# EAGLE schematic main_V3.0 (EAGLE 7.2.0)

## Sheet 1 of 3
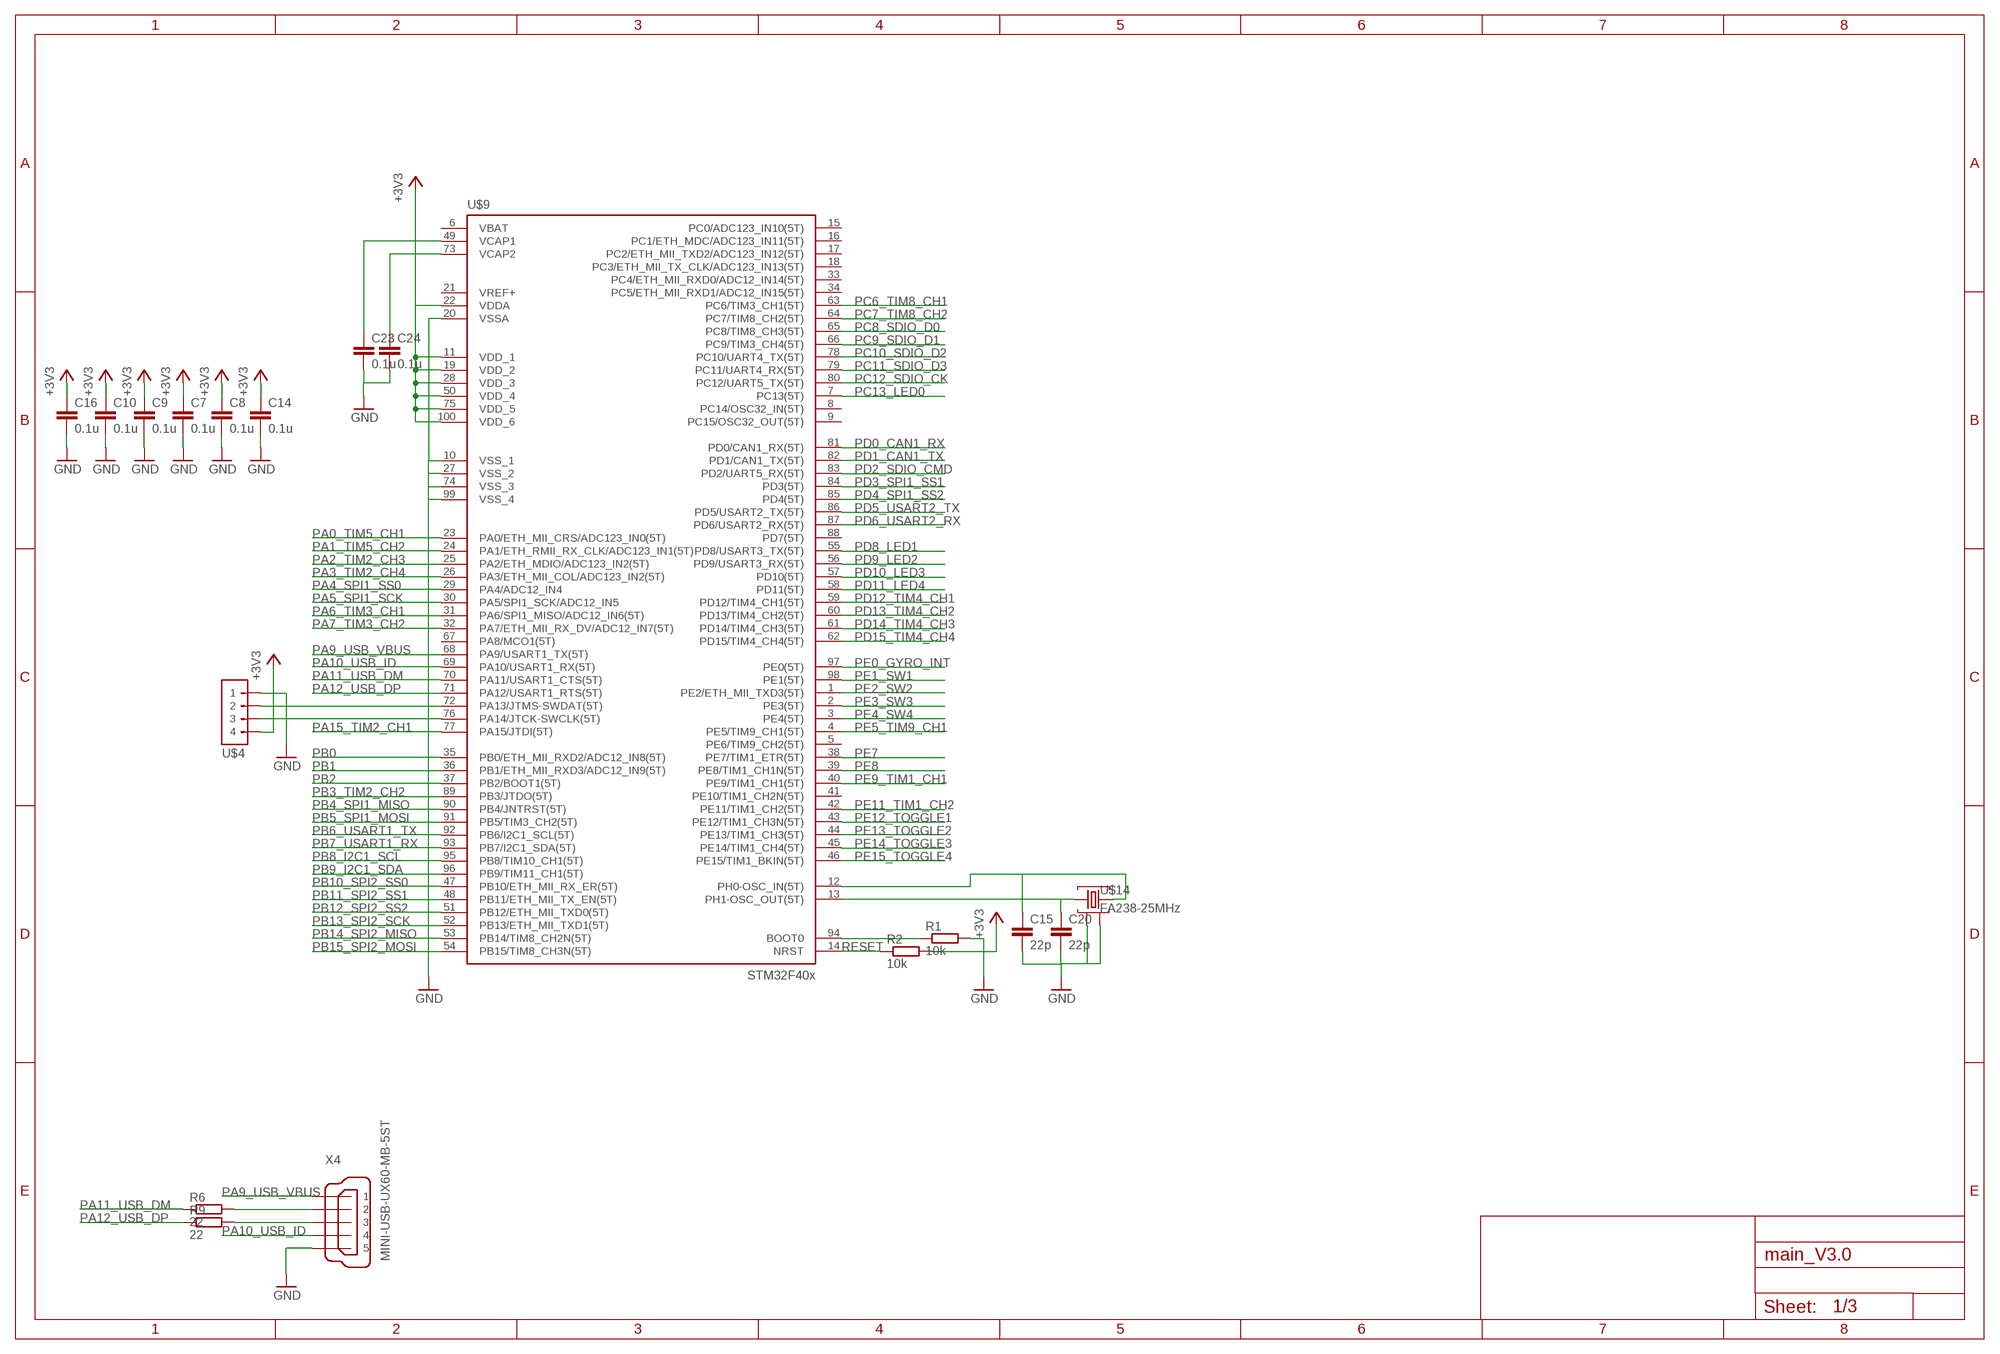
[diagram p0: schematic, sheet 1]

### Parts
C7  0.1u  C-EUC0603K  [C0603K]
C8  0.1u  C-EUC0603K  [C0603K]
C9  0.1u  C-EUC0603K  [C0603K]
C10  0.1u  C-EUC0603K  [C0603K]
C14  0.1u  C-EUC0603K  [C0603K]
C15  22p  C-EUC0603K  [C0603K]
C16  0.1u  C-EUC0603K  [C0603K]
C20  22p  C-EUC0603K  [C0603K]
C23  0.1u  C-EUC0603K  [C0603K]
C24  0.1u  C-EUC0603K  [C0603K]
R1  10k  R-EU_R0603  [R0603]
R2  10k  R-EU_R0603  [R0603]
R6  22  R-EU_R0603  [R0603]
R9  22  R-EU_R0603  [R0603]
U$4  TOP_TYPE_4PIN  [TOP_TYPE_4PIN]
U$9  STM32F407V  [TQFP100]
U$14  FA238-25MHz  FA238  [ASF]
X4  MINI-USB-UX60-MB-5ST  [UX60-MB-5ST]

### Nets
+3V3 [VCC]: C7.1 C8.1 C9.1 C10.1 C14.1 C16.1 R2.2 U$4.4 U$9.11(VDD_1) U$9.19(VDD_2) U$9.22(VDDA) U$9.28(VDD_3) U$9.50(VDD_4) U$9.75(VDD_5) U$9.100(VDD_6) ; also sheet 2,3
GND [GND]: C7.2 C8.2 C9.2 C10.2 C14.2 C15.2 C16.2 C20.2 C23.2 C24.2 R1.2 U$4.1 U$9.10(VSS_1) U$9.20(VSSA) U$9.27(VSS_2) U$9.74(VSS_3) U$9.99(VSS_4) U$14.2 U$14.4 X4.5 ; also sheet 2,3
N$4: R6.2 X4.2
N$5: R9.2 X4.3
N$17: U$4.2 U$9.72(PA13/JTMS-SWDAT(5T))
N$18: U$4.3 U$9.76(PA14/JTCK-SWCLK(5T))
N$19: C15.1 U$9.12(PH0-OSC_IN(5T)) U$14.3
N$20: C20.1 U$9.13(PH1-OSC_OUT(5T)) U$14.1
N$22: R1.1 U$9.94(BOOT0)
N$23: C24.1 U$9.73(VCAP2)
N$27: C23.1 U$9.49(VCAP1)
PA0_TIM5_CH1: U$9.23(PA0/ETH_MII_CRS/ADC123_IN0(5T)) ; also sheet 2
PA1_TIM5_CH2: U$9.24(PA1/ETH_RMII_RX_CLK/ADC123_IN1(5T)) ; also sheet 2
PA2_TIM2_CH3: U$9.25(PA2/ETH_MDIO/ADC123_IN2(5T)) ; also sheet 2
PA3_TIM2_CH4: U$9.26(PA3/ETH_MII_COL/ADC123_IN2(5T)) ; also sheet 2
PA4_SPI1_SS0: U$9.29(PA4/ADC12_IN4) ; also sheet 2
PA5_SPI1_SCK: U$9.30(PA5/SPI1_SCK/ADC12_IN5) ; also sheet 2
PA6_TIM3_CH1: U$9.31(PA6/SPI1_MISO/ADC12_IN6(5T)) ; also sheet 2
PA7_TIM3_CH2: U$9.32(PA7/ETH_MII_RX_DV/ADC12_IN7(5T)) ; also sheet 2
PA9_USB_VBUS: U$9.68(PA9/USART1_TX(5T)) X4.1
PA10_USB_ID: U$9.69(PA10/USART1_RX(5T)) X4.4
PA11_USB_DM: R6.1 U$9.70(PA11/USART1_CTS(5T))
PA12_USB_DP: R9.1 U$9.71(PA12/USART1_RTS(5T))
PA15_TIM2_CH1: U$9.77(PA15/JTDI(5T)) ; also sheet 2
PB0: U$9.35(PB0/ETH_MII_RXD2/ADC12_IN8(5T)) ; also sheet 2
PB1: U$9.36(PB1/ETH_MII_RXD3/ADC12_IN9(5T)) ; also sheet 2
PB2: U$9.37(PB2/BOOT1(5T)) ; also sheet 2
PB3_TIM2_CH2: U$9.89(PB3/JTDO(5T)) ; also sheet 2
PB4_SPI1_MISO: U$9.90(PB4/JNTRST(5T)) ; also sheet 2
PB5_SPI1_MOSI: U$9.91(PB5/TIM3_CH2(5T)) ; also sheet 2
PB6_USART1_TX: U$9.92(PB6/I2C1_SCL(5T)) ; also sheet 2
PB7_USART1_RX: U$9.93(PB7/I2C1_SDA(5T)) ; also sheet 2
PB8_I2C1_SCL: U$9.95(PB8/TIM10_CH1(5T)) ; also sheet 3
PB9_I2C1_SDA: U$9.96(PB9/TIM11_CH1(5T)) ; also sheet 3
PB10_SPI2_SS0: U$9.47(PB10/ETH_MII_RX_ER(5T)) ; also sheet 2
PB11_SPI2_SS1: U$9.48(PB11/ETH_MII_TX_EN(5T)) ; also sheet 2
PB12_SPI2_SS2: U$9.51(PB12/ETH_MII_TXD0(5T)) ; also sheet 2
PB13_SPI2_SCK: U$9.52(PB13/ETH_MII_TXD1(5T)) ; also sheet 2
PB14_SPI2_MISO: U$9.53(PB14/TIM8_CH2N(5T)) ; also sheet 2
PB15_SPI2_MOSI: U$9.54(PB15/TIM8_CH3N(5T)) ; also sheet 2
PC6_TIM8_CH1: U$9.63(PC6/TIM3_CH1(5T)) ; also sheet 2
PC7_TIM8_CH2: U$9.64(PC7/TIM8_CH2(5T)) ; also sheet 2
PC8_SDIO_D0: U$9.65(PC8/TIM8_CH3(5T)) ; also sheet 2
PC9_SDIO_D1: U$9.66(PC9/TIM3_CH4(5T)) ; also sheet 2
PC10_SDIO_D2: U$9.78(PC10/UART4_TX(5T)) ; also sheet 2
PC11_SDIO_D3: U$9.79(PC11/UART4_RX(5T)) ; also sheet 2
PC12_SDIO_CK: U$9.80(PC12/UART5_TX(5T)) ; also sheet 2
PC13_LED0: U$9.7(PC13(5T)) ; also sheet 3
PD0_CAN1_RX: U$9.81(PD0/CAN1_RX(5T)) ; also sheet 2
PD1_CAN1_TX: U$9.82(PD1/CAN1_TX(5T)) ; also sheet 2
PD2_SDIO_CMD: U$9.83(PD2/UART5_RX(5T)) ; also sheet 2
PD3_SPI1_SS1: U$9.84(PD3(5T)) ; also sheet 2
PD4_SPI1_SS2: U$9.85(PD4(5T)) ; also sheet 2
PD5_USART2_TX: U$9.86(PD5/USART2_TX(5T)) ; also sheet 2
PD6_USART2_RX: U$9.87(PD6/USART2_RX(5T)) ; also sheet 2
PD8_LED1: U$9.55(PD8/USART3_TX(5T)) ; also sheet 3
PD9_LED2: U$9.56(PD9/USART3_RX(5T)) ; also sheet 3
PD10_LED3: U$9.57(PD10(5T)) ; also sheet 3
PD11_LED4: U$9.58(PD11(5T)) ; also sheet 3
PD12_TIM4_CH1: U$9.59(PD12/TIM4_CH1(5T)) ; also sheet 2
PD13_TIM4_CH2: U$9.60(PD13/TIM4_CH2(5T)) ; also sheet 2
PD14_TIM4_CH3: U$9.61(PD14/TIM4_CH3(5T)) ; also sheet 2
PD15_TIM4_CH4: U$9.62(PD15/TIM4_CH4(5T)) ; also sheet 2
PE0_GYRO_INT: U$9.97(PE0(5T)) ; also sheet 3
PE1_SW1: U$9.98(PE1(5T)) ; also sheet 3
PE2_SW2: U$9.1(PE2/ETH_MII_TXD3(5T)) ; also sheet 3
PE3_SW3: U$9.2(PE3(5T)) ; also sheet 3
PE4_SW4: U$9.3(PE4(5T)) ; also sheet 3
PE5_TIM9_CH1: U$9.4(PE5/TIM9_CH1(5T)) ; also sheet 3
PE7: U$9.38(PE7/TIM1_ETR(5T)) ; also sheet 2
PE8: U$9.39(PE8/TIM1_CH1N(5T)) ; also sheet 2
PE9_TIM1_CH1: U$9.40(PE9/TIM1_CH1(5T)) ; also sheet 2
PE11_TIM1_CH2: U$9.42(PE11/TIM1_CH2(5T)) ; also sheet 2
PE12_TOGGLE1: U$9.43(PE12/TIM1_CH3N(5T)) ; also sheet 3
PE13_TOGGLE2: U$9.44(PE13/TIM1_CH3(5T)) ; also sheet 3
PE14_TOGGLE3: U$9.45(PE14/TIM1_CH4(5T)) ; also sheet 3
PE15_TOGGLE4: U$9.46(PE15/TIM1_BKIN(5T)) ; also sheet 3
RESET: R2.1 U$9.14(NRST) ; also sheet 2,3
Unconnected: U$9.5(PE6/TIM9_CH2(5T)) U$9.6(VBAT) U$9.8(PC14/OSC32_IN(5T)) U$9.9(PC15/OSC32_OUT(5T)) U$9.15(PC0/ADC123_IN10(5T)) U$9.16(PC1/ETH_MDC/ADC123_IN11(5T)) U$9.17(PC2/ETH_MII_TXD2/ADC123_IN12(5T)) U$9.18(PC3/ETH_MII_TX_CLK/ADC123_IN13(5T)) U$9.21(VREF+) U$9.33(PC4/ETH_MII_RXD0/ADC12_IN14(5T)) U$9.34(PC5/ETH_MII_RXD1/ADC12_IN15(5T)) U$9.41(PE10/TIM1_CH2N(5T)) U$9.67(PA8/MCO1(5T)) U$9.88(PD7(5T))

## Sheet 2 of 3
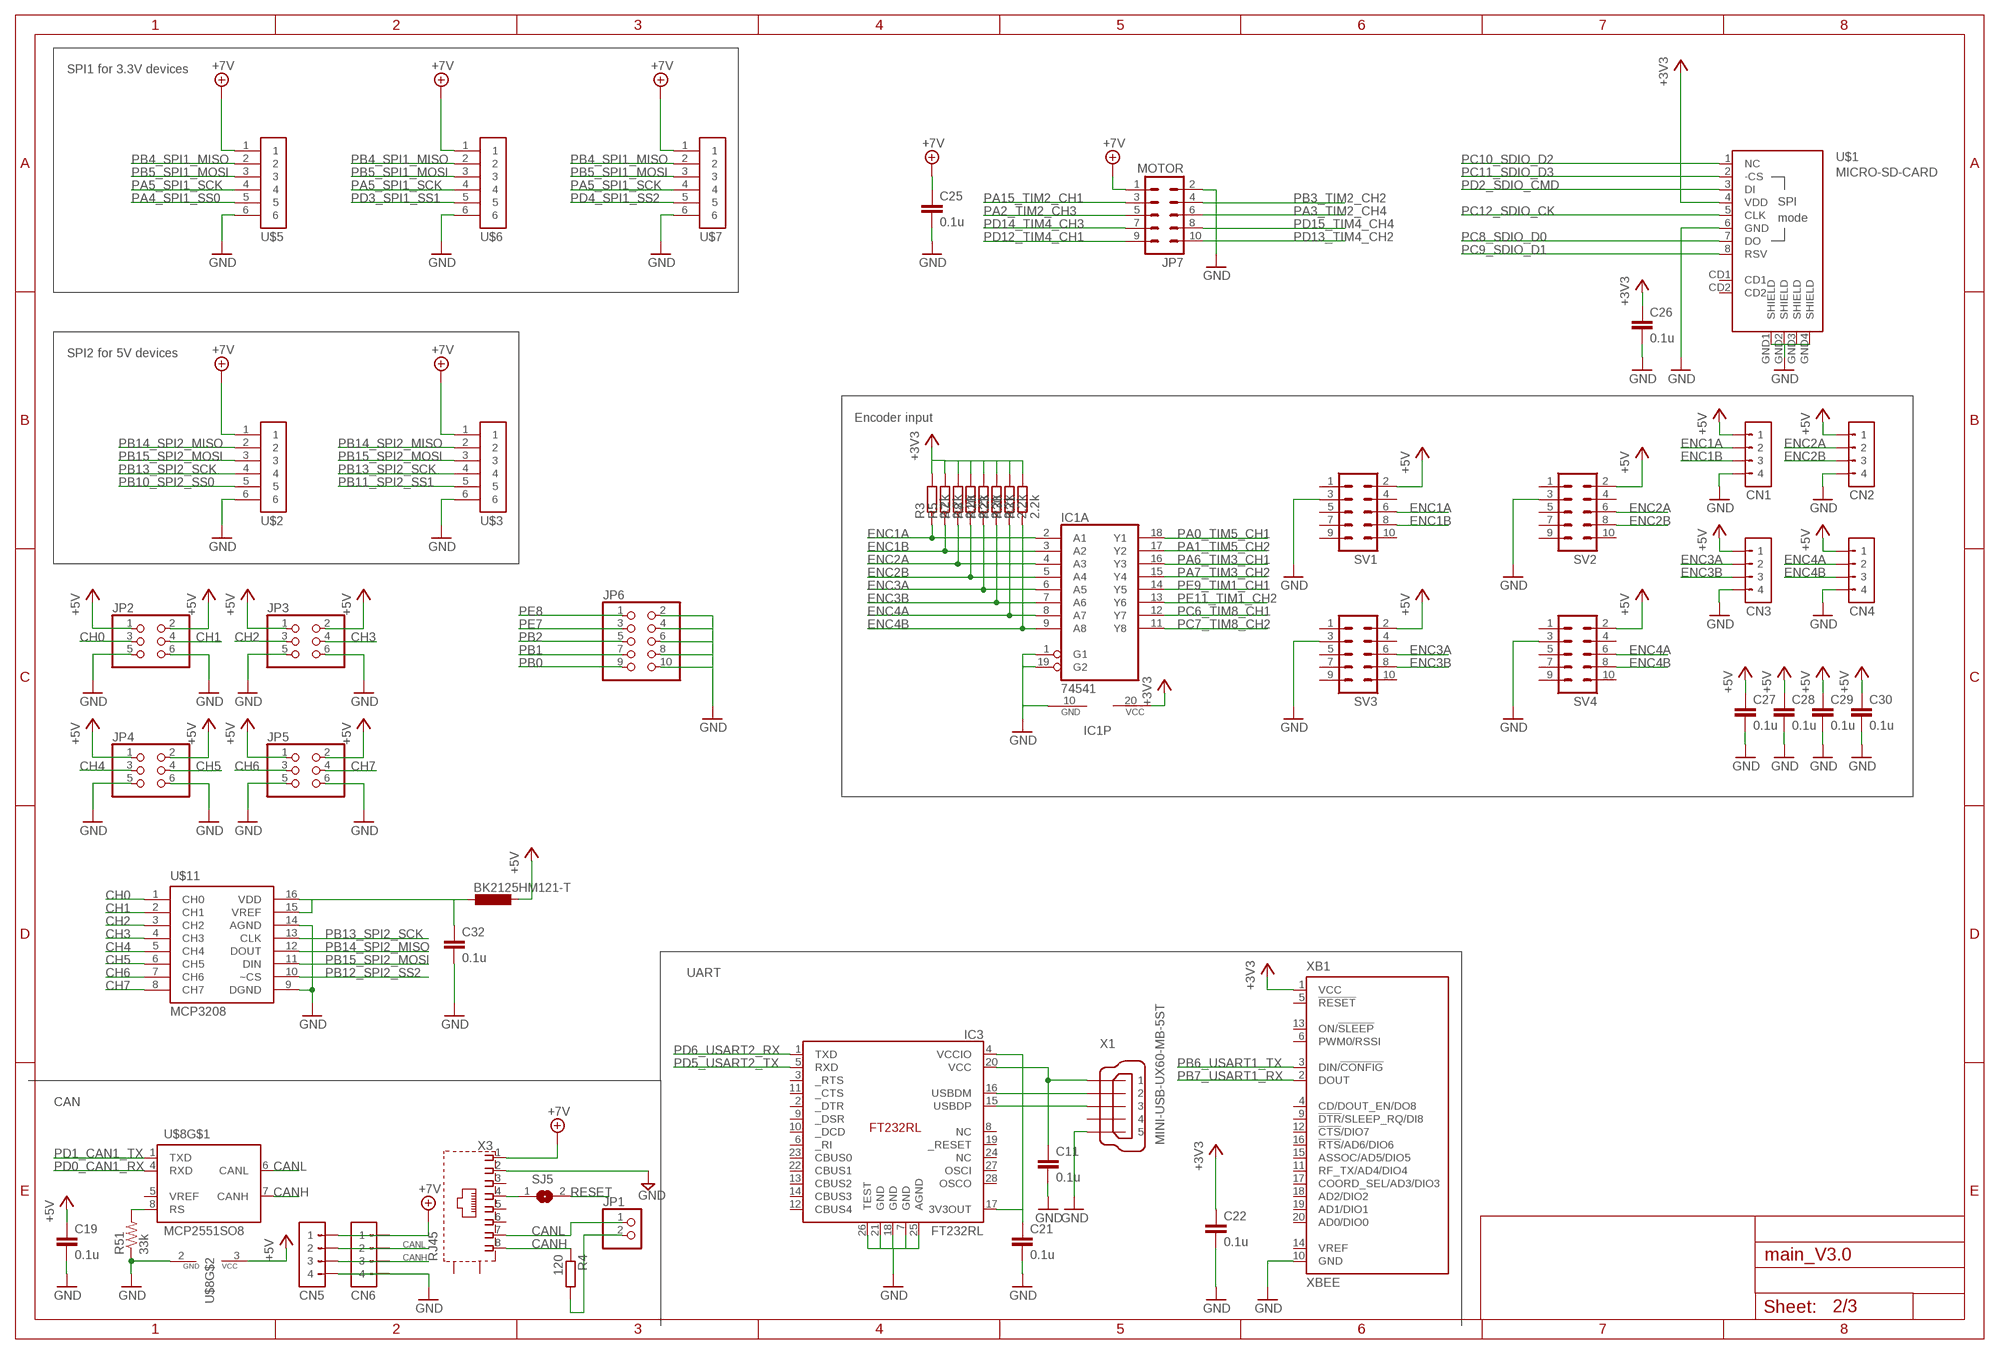
[diagram p1: schematic, sheet 2]

### Parts
BK2125HM121-T  L-EUL2012C  [L2012C]
C11  0.1u  C-EUC0603K  [C0603K]
C19  0.1u  C-EUC0603K  [C0603K]
C21  0.1u  C-EUC0603K  [C0603K]
C22  0.1u  C-EUC0603K  [C0603K]
C25  0.1u  C-EUC0603K  [C0603K]
C26  0.1u  C-EUC0603K  [C0603K]
C27  0.1u  C-EUC0603K  [C0603K]
C28  0.1u  C-EUC0603K  [C0603K]
C29  0.1u  C-EUC0603K  [C0603K]
C30  0.1u  C-EUC0603K  [C0603K]
C32  0.1u  C-EUC0603K  [C0603K]
CN1  CN4-JST-XH-TOP  [JST-B4B-XH-A]
CN2  CN4-JST-XH-TOP  [JST-B4B-XH-A]
CN3  CN4-JST-XH-TOP  [JST-B4B-XH-A]
CN4  CN4-JST-XH-TOP  [JST-B4B-XH-A]
CN5  CN4-JST-XH-TOP  [JST-B4B-XH-A]
CN6  CN4-JST-XH-TOP  [JST-B4B-XH-A]
IC1  74541  [SOP20]
IC3  FT232RL  [SSOP-28]
JP1  PINHD-1X2  [1X02]
JP2  PINHD-2X3/90  [2X03/90]
JP3  PINHD-2X3/90  [2X03/90]
JP4  PINHD-2X3/90  [2X03/90]
JP5  PINHD-2X3/90  [2X03/90]
JP6  PINHD-2X5/90  [2X05/90]
JP7  MOTOR  ML10L  [ML10L]
R3  2.2k  R-EU_R0603  [R0603]
R4  120  R-EU_R0603  [R0603]
R5  2.2k  R-EU_R0603  [R0603]
R7  2.2k  R-EU_R0603  [R0603]
R8  2.2k  R-EU_R0603  [R0603]
R10  2.2k  R-EU_R0603  [R0603]
R23  2.2k  R-EU_R0603  [R0603]
R30  2.2k  R-EU_R0603  [R0603]
R31  2.2k  R-EU_R0603  [R0603]
R51  33k  R-US_R0603  [R0603]
SJ5  SJ  [SJ]
SV1  ML10L  [ML10L]
SV2  ML10L  [ML10L]
SV3  ML10L  [ML10L]
SV4  ML10L  [ML10L]
U$1  MICRO-SD-CARD  [DM3AT-SF-PEJ]
U$2  CN6  [JST-B6B-XH-A]
U$3  CN6  [JST-B6B-XH-A]
U$5  CN6  [JST-B6B-XH-A]
U$6  CN6  [JST-B6B-XH-A]
U$7  CN6  [JST-B6B-XH-A]
U$8  MCP2551SO8  [SO08]
U$11  MCP3208  [SO16]
X1  MINI-USB-UX60-MB-5ST  [UX60-MB-5ST]
X3  RJ45  [LAN]
XB1  XBEE  [XBEE]

### Nets
+3V3 [VCC]: C22.1 C26.1 IC1.20(P:VCC) R3.2 R5.2 R7.2 R8.2 R10.2 R23.2 R30.2 R31.2 U$1.4(VDD) XB1.1(VCC) ; also sheet 1,3
+5V [VCC]: BK2125HM121-T.1 C19.1 C27.1 C28.1 C29.1 C30.1 CN1.1 CN2.1 CN3.1 CN4.1 JP2.1 JP2.2 JP3.1 JP3.2 JP4.1 JP4.2 JP5.1 JP5.2 SV1.2 SV2.2 SV3.2 SV4.2 U$8.3(VCC) ; also sheet 3
+7V [VCC]: C25.1 CN5.1 CN6.1 JP7.1 U$2.1 U$3.1 U$5.1 U$6.1 U$7.1 X3.1 ; also sheet 3
CANH: CN5.3 CN6.3 R4.1 U$8.7(CANH) X3.8
CANL: CN5.2 CN6.2 JP1.1 U$8.6(CANL) X3.7
CH0: JP2.3 U$11.1(CH0)
CH1: JP2.4 U$11.2(CH1)
CH2: JP3.3 U$11.3(CH2)
CH3: JP3.4 U$11.4(CH3)
CH4: JP4.3 U$11.5(CH4)
CH5: JP4.4 U$11.6(CH5)
CH6: JP5.3 U$11.7(CH6)
CH7: JP5.4 U$11.8(CH7)
ENC1A: CN1.2 IC1.2(A:A1) R3.1 SV1.6
ENC1B: CN1.3 IC1.3(A:A2) R5.1 SV1.8
ENC2A: CN2.2 IC1.4(A:A3) R7.1 SV2.6
ENC2B: CN2.3 IC1.5(A:A4) R8.1 SV2.8
ENC3A: CN3.2 IC1.6(A:A5) R10.1 SV3.6
ENC3B: CN3.3 IC1.7(A:A6) R23.1 SV3.8
ENC4A: CN4.2 IC1.8(A:A7) R30.1 SV4.6
ENC4B: CN4.3 IC1.9(A:A8) R31.1 SV4.8
GND [GND]: C11.2 C19.2 C21.2 C22.2 C25.2 C26.2 C27.2 C28.2 C29.2 C30.2 C32.2 CN1.4 CN2.4 CN3.4 CN4.4 CN5.4 CN6.4 IC1.1(A:G1) IC1.10(P:GND) IC1.19(A:G2) IC3.7(GND) IC3.18(GND) IC3.21(GND) IC3.25(AGND) IC3.26(TEST) JP2.5 JP2.6 JP3.5 JP3.6 JP4.5 JP4.6 JP5.5 JP5.6 JP6.2 JP6.4 JP6.6 JP6.8 JP6.10 JP7.2 R51.1 SV1.3 SV2.3 SV3.3 SV4.3 U$1.6(GND) U$1.GND1(SHIELD) U$1.GND2(SHIELD) U$1.GND3(SHIELD) U$1.GND4(SHIELD) U$2.6 U$3.6 U$5.6 U$6.6 U$7.6 U$8.2(GND) U$11.9(DGND) U$11.14(AGND) X1.5 X3.2 XB1.10(GND) ; also sheet 1,3
N$2: IC3.16(USBDM) X1.2
N$3: IC3.15(USBDP) X1.3
N$9: R51.2 U$8.8(RS)
N$11: SJ5.1 X3.4
N$14 [VCC]: C11.1 IC3.20(VCC) X1.1
N$25: JP1.2 R4.2
N$26: BK2125HM121-T.2 C32.1 U$11.15(VREF) U$11.16(VDD)
N$38 [VCC]: C21.1 IC3.4(VCCIO) IC3.17(3V3OUT)
PA0_TIM5_CH1: IC1.18(A:Y1) ; also sheet 1
PA1_TIM5_CH2: IC1.17(A:Y2) ; also sheet 1
PA2_TIM2_CH3: JP7.5 ; also sheet 1
PA3_TIM2_CH4: JP7.6 ; also sheet 1
PA4_SPI1_SS0: U$5.5 ; also sheet 1
PA5_SPI1_SCK: U$5.4 U$6.4 U$7.4 ; also sheet 1
PA6_TIM3_CH1: IC1.16(A:Y3) ; also sheet 1
PA7_TIM3_CH2: IC1.15(A:Y4) ; also sheet 1
PA15_TIM2_CH1: JP7.3 ; also sheet 1
PB0: JP6.9 ; also sheet 1
PB1: JP6.7 ; also sheet 1
PB2: JP6.5 ; also sheet 1
PB3_TIM2_CH2: JP7.4 ; also sheet 1
PB4_SPI1_MISO: U$5.2 U$6.2 U$7.2 ; also sheet 1
PB5_SPI1_MOSI: U$5.3 U$6.3 U$7.3 ; also sheet 1
PB6_USART1_TX: XB1.3(DIN/!CONFIG) ; also sheet 1
PB7_USART1_RX: XB1.2(DOUT) ; also sheet 1
PB10_SPI2_SS0: U$2.5 ; also sheet 1
PB11_SPI2_SS1: U$3.5 ; also sheet 1
PB12_SPI2_SS2: U$11.10(~CS) ; also sheet 1
PB13_SPI2_SCK: U$2.4 U$3.4 U$11.13(CLK) ; also sheet 1
PB14_SPI2_MISO: U$2.2 U$3.2 U$11.12(DOUT) ; also sheet 1
PB15_SPI2_MOSI: U$2.3 U$3.3 U$11.11(DIN) ; also sheet 1
PC6_TIM8_CH1: IC1.12(A:Y7) ; also sheet 1
PC7_TIM8_CH2: IC1.11(A:Y8) ; also sheet 1
PC8_SDIO_D0: U$1.7(DO) ; also sheet 1
PC9_SDIO_D1: U$1.8(RSV) ; also sheet 1
PC10_SDIO_D2: U$1.1(NC) ; also sheet 1
PC11_SDIO_D3: U$1.2(-CS) ; also sheet 1
PC12_SDIO_CK: U$1.5(CLK) ; also sheet 1
PD0_CAN1_RX: U$8.4(RXD) ; also sheet 1
PD1_CAN1_TX: U$8.1(TXD) ; also sheet 1
PD2_SDIO_CMD: U$1.3(DI) ; also sheet 1
PD3_SPI1_SS1: U$6.5 ; also sheet 1
PD4_SPI1_SS2: U$7.5 ; also sheet 1
PD5_USART2_TX: IC3.5(RXD) ; also sheet 1
PD6_USART2_RX: IC3.1(TXD) ; also sheet 1
PD12_TIM4_CH1: JP7.9 ; also sheet 1
PD13_TIM4_CH2: JP7.10 ; also sheet 1
PD14_TIM4_CH3: JP7.7 ; also sheet 1
PD15_TIM4_CH4: JP7.8 ; also sheet 1
PE7: JP6.3 ; also sheet 1
PE8: JP6.1 ; also sheet 1
PE9_TIM1_CH1: IC1.14(A:Y5) ; also sheet 1
PE11_TIM1_CH2: IC1.13(A:Y6) ; also sheet 1
RESET: SJ5.2 ; also sheet 1,3
Unconnected: IC3.2(_DTR) IC3.3(_RTS) IC3.6(_RI) IC3.8(NC) IC3.9(_DSR) IC3.10(_DCD) IC3.11(_CTS) IC3.12(CBUS4) IC3.13(CBUS2) IC3.14(CBUS3) IC3.19(_RESET) IC3.22(CBUS1) IC3.23(CBUS0) IC3.24(NC) IC3.27(OSCI) IC3.28(OSCO) SV1.1 SV1.4 SV1.5 SV1.7 SV1.9 SV1.10 SV2.1 SV2.4 SV2.5 SV2.7 SV2.9 SV2.10 SV3.1 SV3.4 SV3.5 SV3.7 SV3.9 SV3.10 SV4.1 SV4.4 SV4.5 SV4.7 SV4.9 SV4.10 U$1.CD1 U$1.CD2 U$8.5(VREF) X1.4 X3.3 X3.5 X3.6 X3.P$11(S) X3.P$12(S) XB1.4(CD/DOUT_EN/DO8) XB1.5(!RESET) XB1.6(PWM0/RSSI) XB1.9(!DTR!/SLEEP_RQ/DI8) XB1.11(RF_TX/AD4/DIO4) XB1.12(!CTS!/DIO7) XB1.13(ON/!SLEEP) XB1.14(VREF) XB1.15(ASSOC/AD5/DIO5) XB1.16(!RTS!/AD6/DIO6) XB1.17(COORD_SEL/AD3/DIO3) XB1.18(AD2/DIO2) XB1.19(AD1/DIO1) XB1.20(AD0/DIO0)

### Notes on the sheet
- SPI1 for 3.3V devices
- SPI2 for 5V devices
- Encoder input
- UART
- CAN

## Sheet 3 of 3
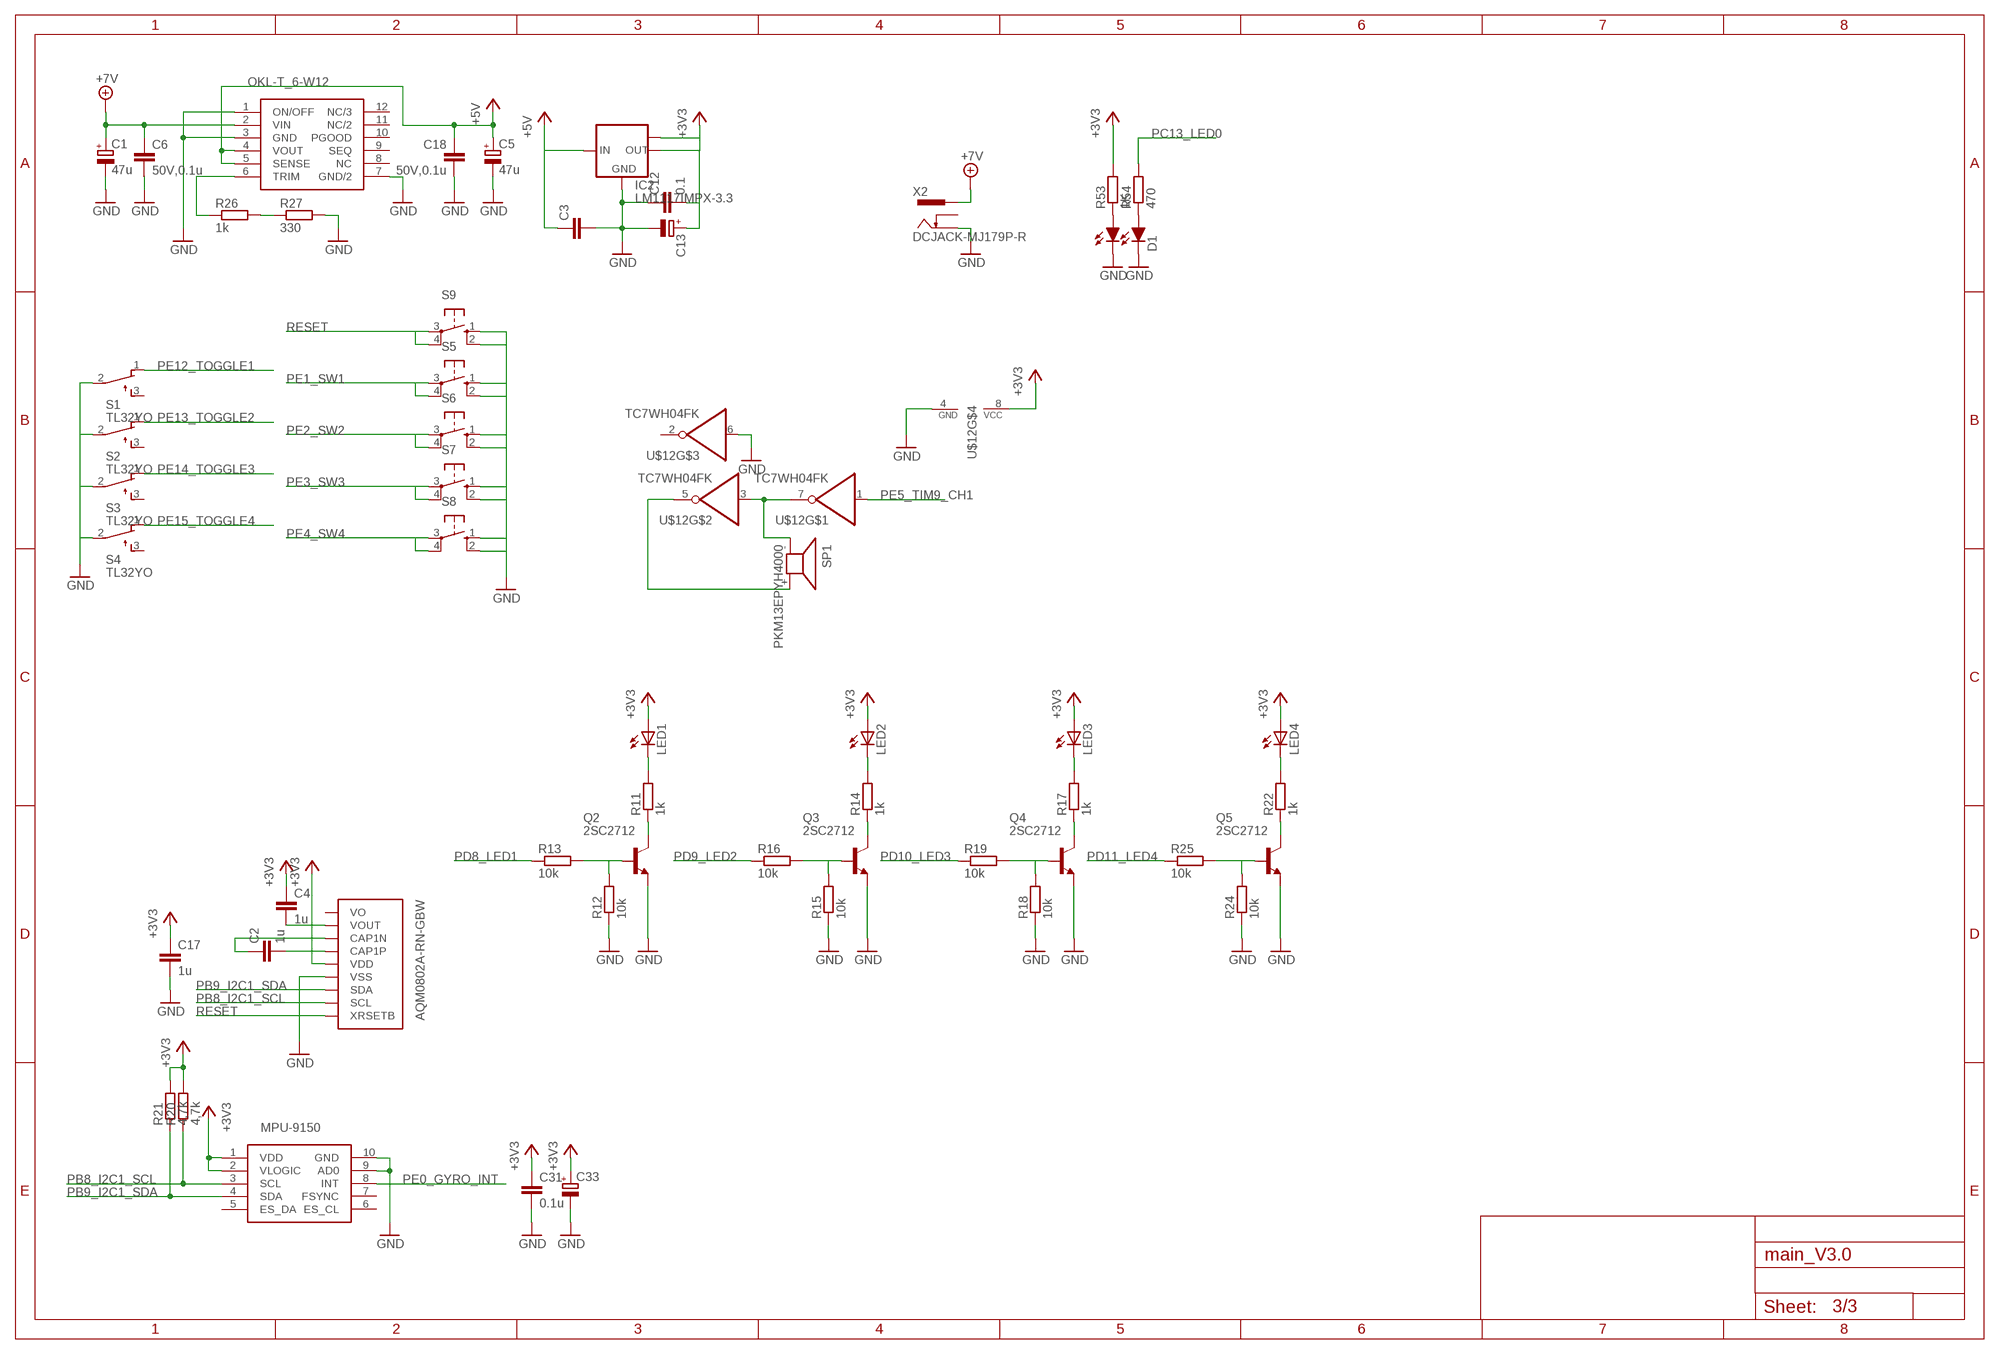
[diagram p2: schematic, sheet 3]

### Parts
AQM0802A-RN-GBW  AQM0802A-RN-GBW  [AQM0802]
C1  47u  CPOL-EU153CLV-0405  [153CLV-0405]
C2  1u  C-EUC0603K  [C0603K]
C3  C-EUC0603  [C0603]
C4  1u  C-EUC0603K  [C0603K]
C5  47u  CPOL-EU153CLV-0405  [153CLV-0405]
C6  50V,0.1u  C-EUC0603K  [C0603K]
C12  0.1  C-EUC0603  [C0603]
C13  CPOL-EU153CLV-0505  [153CLV-0505]
C17  1u  C-EUC0603K  [C0603K]
C18  50V,0.1u  C-EUC0603K  [C0603K]
C31  0.1u  C-EUC0603K  [C0603K]
C33  CPOL-EU153CLV-0505  [153CLV-0505]
D1  SEC2XX4  [LED3025]
IC2  LM1117IMPX-3.3  [SOT223]
LED1  LEDSML0603  [SML0603]
LED2  LEDSML0603  [SML0603]
LED3  LEDSML0603  [SML0603]
LED4  LEDSML0603  [SML0603]
Q2  2SC2712  [SC-59(TYPE1)]
Q3  2SC2712  [SC-59(TYPE1)]
Q4  2SC2712  [SC-59(TYPE1)]
Q5  2SC2712  [SC-59(TYPE1)]
R11  1k  R-EU_R0603  [R0603]
R12  10k  R-EU_R0603  [R0603]
R13  10k  R-EU_R0603  [R0603]
R14  1k  R-EU_R0603  [R0603]
R15  10k  R-EU_R0603  [R0603]
R16  10k  R-EU_R0603  [R0603]
R17  1k  R-EU_R0603  [R0603]
R18  10k  R-EU_R0603  [R0603]
R19  10k  R-EU_R0603  [R0603]
R20  4,7k  R-EU_R0603  [R0603]
R21  4,7k  R-EU_R0603  [R0603]
R22  1k  R-EU_R0603  [R0603]
R24  10k  R-EU_R0603  [R0603]
R25  10k  R-EU_R0603  [R0603]
R26  1k  R-EU_R0603  [R0603]
R27  330  R-EU_R0603  [R0603]
R53  1K  R-EU_R0603  [R0603]
R54  470  R-EU_R0603  [R0603]
S1  TL32YO  [TL3XYO]
S2  TL32YO  [TL3XYO]
S3  TL32YO  [TL3XYO]
S4  TL32YO  [TL3XYO]
S5  10-XX  [B3F-10XX]
S6  10-XX  [B3F-10XX]
S7  10-XX  [B3F-10XX]
S8  10-XX  [B3F-10XX]
S9  10-XX  [B3F-10XX]
SP1  PKM13EPYH4000  AL11P  [AL11P]
U$10  MPU-9150  [MPU-9150]
U$12  TC7WH04FK  [SSOP08]
U$13  OKL-T/6-W12N  [OKL-T/6-W12]
X2  DCJACK-MJ179P-R  [MJ-179P-R]

### Nets
+3V3 [VCC]: AQM0802A-RN-GBW.P$5(VDD) C4.1 C12.2 C13.+ C17.1 C31.1 C33.+ IC2.2(OUT) IC2.TAB(OUT1) LED1.A LED2.A LED3.A LED4.A R20.2 R21.2 R53.2 U$10.1(VDD) U$10.2(VLOGIC) U$12.8(VCC) ; also sheet 1,2
+5V [VCC]: C3.1 C5.+ C18.1 IC2.3(IN) U$13.4(VOUT) U$13.5(SENSE) ; also sheet 2
+7V [VCC]: C1.+ C6.1 U$13.2(VIN) X2.1 ; also sheet 2
GND [GND]: AQM0802A-RN-GBW.P$6(VSS) C1.- C3.2 C5.- C6.2 C12.1 C13.- C17.2 C18.2 C31.2 C33.- D1.1(C0) D1.2(C1) IC2.1(GND) Q2.E Q3.E Q4.E Q5.E R12.1 R15.1 R18.1 R24.1 R27.2 S1.2(P) S2.2(P) S3.2(P) S4.2(P) S5.1(S) S5.2(S1) S6.1(S) S6.2(S1) S7.1(S) S7.2(S1) S8.1(S) S8.2(S1) S9.1(S) S9.2(S1) U$10.9(AD0) U$10.10(GND) U$12.4(GND) U$12.6(I) U$13.1(ON/OFF) U$13.3(GND) U$13.7(GND/2) X2.2 ; also sheet 1,2
N$8: AQM0802A-RN-GBW.P$4(CAP1P) C2.2
N$10: AQM0802A-RN-GBW.P$2(VOUT) C4.2
N$12: Q2.C R11.1
N$13: D1.3(A1) R53.1
N$15: LED1.C R11.2
N$16: AQM0802A-RN-GBW.P$3(CAP1N) C2.1
N$21: SP1.- U$12.3(I) U$12.7(O)
N$24: D1.4(A0) R54.1
N$28: SP1.+ U$12.5(O)
N$29: Q3.C R14.1
N$30: Q3.B R15.2 R16.2
N$31: LED2.C R14.2
N$32: Q4.C R17.1
N$33: Q4.B R18.2 R19.2
N$34: LED3.C R17.2
N$35: Q5.C R22.1
N$36: Q5.B R24.2 R25.2
N$37: LED4.C R22.2
N$39: R26.1 U$13.6(TRIM)
N$40: R26.2 R27.1
N$115: Q2.B R12.2 R13.2
PB8_I2C1_SCL: AQM0802A-RN-GBW.P$8(SCL) R20.1 U$10.3(SCL) ; also sheet 1
PB9_I2C1_SDA: AQM0802A-RN-GBW.P$7(SDA) R21.1 U$10.4(SDA) ; also sheet 1
PC13_LED0: R54.2 ; also sheet 1
PD8_LED1: R13.1 ; also sheet 1
PD9_LED2: R16.1 ; also sheet 1
PD10_LED3: R19.1 ; also sheet 1
PD11_LED4: R25.1 ; also sheet 1
PE0_GYRO_INT: U$10.8(INT) ; also sheet 1
PE1_SW1: S5.3(P) S5.4(P1) ; also sheet 1
PE2_SW2: S6.3(P) S6.4(P1) ; also sheet 1
PE3_SW3: S7.3(P) S7.4(P1) ; also sheet 1
PE4_SW4: S8.3(P) S8.4(P1) ; also sheet 1
PE5_TIM9_CH1: U$12.1(I) ; also sheet 1
PE12_TOGGLE1: S1.1(O) ; also sheet 1
PE13_TOGGLE2: S2.1(O) ; also sheet 1
PE14_TOGGLE3: S3.1(O) ; also sheet 1
PE15_TOGGLE4: S4.1(O) ; also sheet 1
RESET: AQM0802A-RN-GBW.P$9(XRSETB) S9.3(P) S9.4(P1) ; also sheet 1,2
Unconnected: AQM0802A-RN-GBW.P$1(VO) S1.3(S) S2.3(S) S3.3(S) S4.3(S) U$10.5(ES_DA) U$10.6(ES_CL) U$10.7(FSYNC) U$12.2(O) U$13.8(NC) U$13.9(SEQ) U$13.10(PGOOD) U$13.11(NC/2) U$13.12(NC/3) X2.3

## Library data of the parts
AQM0802A-RN-GBW = densikit:AQM0802A-RN-GBW
BK2125HM121-T = resistor:L-EU: INDUCTOR, European symbol
C1 C5 C13 C33 = rcl:CPOL-EU: POLARIZED CAPACITOR, European symbol
C2-C4 C6-C12 C14-C32 = resistor:C-EU: CAPACITOR, European symbol
CN1-CN6 = con-jst_xh:CN4: Connector 4 circuits
D1 = SRT162-010:SEC2XX4
IC1 = TC74HC541AF:74*541: Octal BUFFER and LINE DRIVER, 3-state
IC2 = lm1117:LM1117IMPX-*
IC3 = ftdi:FT232RL
JP1 = pinhead:PINHD-1X2: PIN HEADER
JP2-JP5 = pinhead:PINHD-2X3: PIN HEADER
JP6 = pinhead:PINHD-2X5: PIN HEADER
JP7 = MIL-Conector:ML10L: HARTING
LED1-LED4 = led:LED: LED OSRAM: - CHIPLED LG R971, LG N971, LY N971, LG Q971, LY Q971, LO R971, LY R971 LH N974, LH R974 LS Q976, LO Q976, LY Q976 LO Q996 - Hyper CHIPLED LW Q18S LB Q993, LB Q99A, LB R99A - SideLED LS A670, LO A670, LY A670, LG A670, LP A670 LB A673, LV A673, LT A673, LW A673 LH A674 LY A675 LS A676, LA A676, LO A676, LY A676, LW A676 LS A679, LY A679, LG A679 - Hyper Micro SIDELED® LS Y876, LA Y876, LO Y876, LY Y876 LT Y87S - SmartLED LW L88C, LW L88S LB L89C, LB L89S, LG L890 LS L89K, LO L89K, LY L89K LS L896, LA L896, LO L896, LY L896 - TOPLED LS T670, LO T670, LY T670, LG T670, LP T670 LSG T670, LSP T670, LSY T670, LOP T670, LYG T670 LG T671, LOG T671, LSG T671 LB T673, LV T673, LT T673, LW T673 LH T674 LS T676, LA T676, LO T676, LY T676, LB T676, LH T676, LSB T676, LW T676 LB T67C, LV T67C, LT T67C, LS T67K, LO T67K, LY T67K, LW E67C LS E67B, LA E67B, LO E67B, LY E67B, LB E67C, LV E67C, LT E67C LW T67C LS T679, LY T679, LG T679 LS T770, LO T770, LY T770, LG T770, LP T770 LB T773, LV T773, LT T773, LW T773 LH T774 LS E675, LA E675, LY E675, LS T675 LS T776, LA T776, LO T776, LY T776, LB T776 LHGB T686 LT T68C, LB T68C - Hyper Mini TOPLED® LB M676 - Mini TOPLED Santana® LG M470 LS M47K, LO M47K, LY M47K Source: http://www.osram.convergy.de LUXEON: - LUMILED® LXK2-PW12-R00, LXK2-PW12-S00, LXK2-PW14-U00, LXK2-PW14-V00 LXK2-PM12-R00, LXK2-PM12-S00, LXK2-PM14-U00 LXK2-PE12-Q00, LXK2-PE12-R00, LXK2-PE12-S00, LXK2-PE14-T00, LXK2-PE14-U00 LXK2-PB12-K00, LXK2-PB12-L00, LXK2-PB12-M00, LXK2-PB14-N00, LXK2-PB14-P00, LXK2-PB14-Q00 LXK2-PR12-L00, LXK2-PR12-M00, LXK2-PR14-Q00, LXK2-PR14-R00 LXK2-PD12-Q00, LXK2-PD12-R00, LXK2-PD12-S00 LXK2-PH12-R00, LXK2-PH12-S00 LXK2-PL12-P00, LXK2-PL12-Q00, LXK2-PL12-R00 Source: www.luxeon.com KINGBRIGHT: KA-3528ASYC Source: www.kingbright.com
Q2-Q5 = Transistor:2SC2712
R1-R27 R30 R31 R53 R54 = resistor:R-EU_: RESISTOR, European symbol
R51 = resistor:R-US_: RESISTOR, American symbol
S1-S4 = switch:TL32YO: TINY SWITCH ON - MOM Source: http://www2.produktinfo.conrad.com/datenblaetter/700000-724999/705152-da-01-de-Subminiaturschalter_TL_36YO.pdf
S5-S9 = switch-omron:10-XX: OMRON SWITCH; MPN: B3F-1000; OC_FARNELL: 176432; OC_NEWARK: 36M3542
SJ5 = jumper:SJ: SMD solder JUMPER
SP1 = buzzer:AL11P: SPEAKER Source: Buerklin; OC_FARNELL: unknown; OC_NEWARK: unknown
SV1-SV4 = con-ml:ML10L: HARTING; OC_FARNELL: unknown; OC_NEWARK: unknown
U$1 = micro_sd:MICRO-SD-CARD: HIROSE microSD socket DM3AT-SF-PEJ
U$2 U$3 U$5-U$7 = con-jst_xh:CN6
U$4 = GHconnector:TOP_TYPE_4PIN
U$8 = can:MCP2551: CAN Tranceiver Microchip
U$9 = stm32f4:STM32F407V: STM32F407 100 pin LQFP reviewed: YES tested: YES
U$10 = MPU-9150:MPU-9150
U$11 = mcp3208:MCP3208
U$12 = TC7WH04FK:TC7WH04FK
U$13 = OKL-T_6-W12:OKL-T/6-W12N
U$14 = FA238:FA238
X1 X4 = con-hirose:MINI-USB-: MINI USB Connector Source: http://www.hirose.co.jp/cataloge_hp/e24000019.pdf; OC_FARNELL: unknown; OC_NEWARK: unknown
X2 = akizuki-dcjack:DCJACK: DC JACK 2.1mmφ - 5.5mmφ DCジャック、基板用。
X3 = RJ45:RJ45
XB1 = microbuilder:XBEE: XBee (TM) /XBee-PRO(TM) OEM RF Modules Source: MaxStream, Inc. xbee_productmanual.pdf